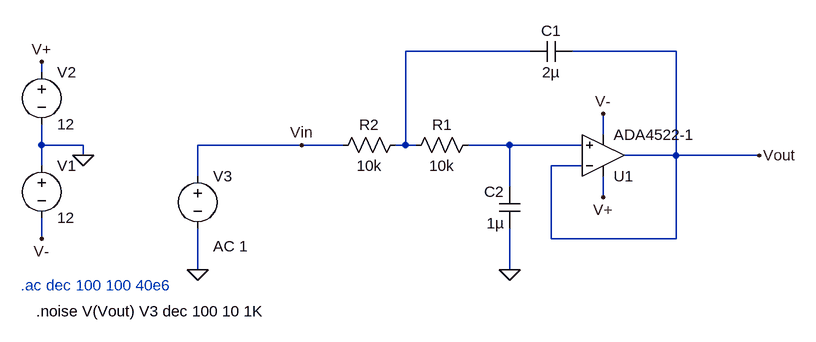
[diagram p0: schematic SecondOrderSK_LowPass.asc]
SecondOrderSK_LowPass.asc, the LTspice schematic file:
Version 4
SHEET 1 880 680
WIRE 416 -32 224 -32
WIRE 640 -32 480 -32
WIRE -336 0 -336 -16
WIRE 528 96 528 64
WIRE -336 112 -336 80
WIRE -272 112 -336 112
WIRE 64 112 -96 112
WIRE 128 112 64 112
WIRE 224 112 224 -32
WIRE 224 112 208 112
WIRE 240 112 224 112
WIRE 384 112 320 112
WIRE 496 112 384 112
WIRE -272 128 -272 112
WIRE 640 128 640 -32
WIRE 640 128 560 128
WIRE 768 128 640 128
WIRE -336 144 -336 112
WIRE 496 144 448 144
WIRE -96 160 -96 112
WIRE 384 176 384 112
WIRE 528 192 528 160
WIRE -336 256 -336 224
WIRE 448 256 448 144
WIRE 640 256 640 128
WIRE 640 256 448 256
WIRE -96 304 -96 240
WIRE 384 304 384 240
FLAG -272 128 0
FLAG -336 256 V-
FLAG -336 -16 V+
FLAG 528 192 V+
FLAG 528 64 V-
FLAG 768 128 Vout
FLAG 64 112 Vin
FLAG -96 304 0
FLAG 384 304 0
SYMBOL Opamps\\ADA4522-1 528 192 M180
SYMATTR InstName U1
SYMBOL voltage -336 128 R0
WINDOW 123 0 0 Left 0
WINDOW 39 0 0 Left 0
SYMATTR InstName V1
SYMATTR Value 12
SYMBOL voltage -336 -16 R0
WINDOW 123 0 0 Left 0
WINDOW 39 0 0 Left 0
SYMATTR InstName V2
SYMATTR Value 12
SYMBOL res 336 96 R90
WINDOW 0 0 56 VBottom 2
WINDOW 3 32 56 VTop 2
SYMATTR InstName R1
SYMATTR Value 10k
SYMBOL res 224 96 R90
WINDOW 0 0 56 VBottom 2
WINDOW 3 32 56 VTop 2
SYMATTR InstName R2
SYMATTR Value 10k
SYMBOL cap 480 -48 R90
WINDOW 0 0 32 VBottom 2
WINDOW 3 32 32 VTop 2
SYMATTR InstName C1
SYMATTR Value 2µ
SYMBOL cap 400 240 R180
WINDOW 0 24 56 Left 2
WINDOW 3 24 8 Left 2
SYMATTR InstName C2
SYMATTR Value 1µ
SYMBOL voltage -96 144 R0
WINDOW 123 24 124 Left 2
WINDOW 39 0 0 Left 0
SYMATTR Value2 AC 1
SYMATTR InstName V3
SYMATTR Value ""
TEXT -368 328 Left 2 ;.ac dec 100 100 40e6
TEXT -344 368 Left 2 !.noise V(Vout) V3 dec 100 10 1K

The netlist it stands for:
* SecondOrderSK_LowPass.asc
XU1 N002 Vout V+ V- Vout ADA4522-1  ; pins In+ In- V+ V- OUT
V1 0 V- 12
V2 V+ 0 12
R1 N002 N001 10k
R2 N001 Vin 10k
C1 Vout N001 2µ
C2 0 N002 1µ
V3 Vin 0 AC 1
* .ac dec 100 100 40e6
.noise V(Vout) V3 dec 100 10 1K
.backanno
.end